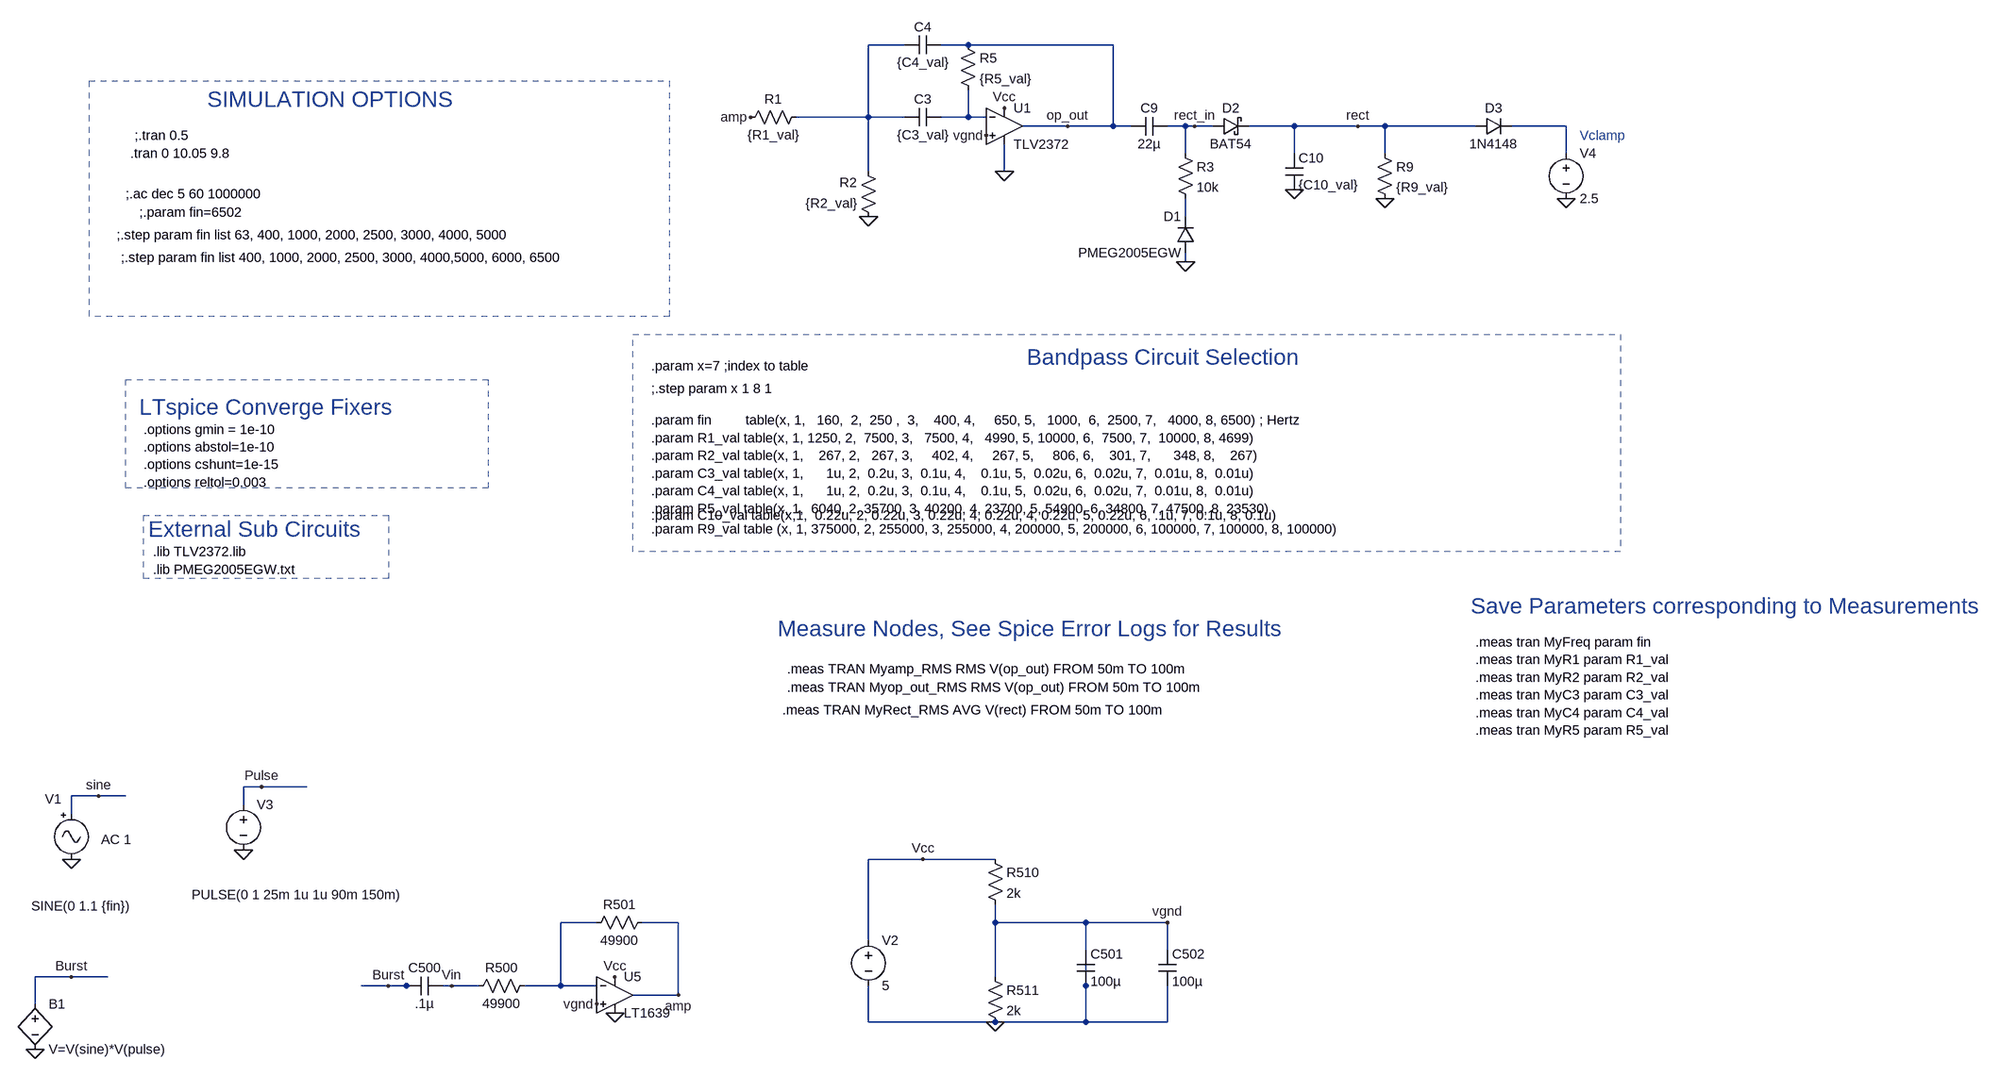
[diagram p0: schematic Single Stage - TLV2372.asc]
Single Stage - TLV2372.asc, the LTspice schematic file:
Version 4
SHEET 1 3616 1460
WIRE 1136 -928 1072 -928
WIRE 1248 -928 1200 -928
WIRE 1504 -928 1248 -928
WIRE 1072 -800 1072 -928
WIRE 1072 -800 944 -800
WIRE 1136 -800 1072 -800
WIRE 1248 -800 1248 -848
WIRE 1248 -800 1200 -800
WIRE 1280 -800 1248 -800
WIRE 1424 -784 1344 -784
WIRE 1504 -784 1504 -928
WIRE 1504 -784 1424 -784
WIRE 1536 -784 1504 -784
WIRE 1632 -784 1600 -784
WIRE 1648 -784 1632 -784
WIRE 1680 -784 1648 -784
WIRE 1824 -784 1744 -784
WIRE 1936 -784 1824 -784
WIRE 1984 -784 1936 -784
WIRE 2144 -784 1984 -784
WIRE 2304 -784 2208 -784
WIRE 1632 -736 1632 -784
WIRE 1824 -736 1824 -784
WIRE 1984 -736 1984 -784
WIRE 2304 -736 2304 -784
WIRE 1072 -704 1072 -800
WIRE 1312 -704 1312 -752
WIRE 1632 -624 1632 -656
WIRE 1632 -544 1632 -560
WIRE 0 384 -32 384
WIRE 80 384 0 384
WIRE -288 400 -336 400
WIRE -240 400 -288 400
WIRE -32 416 -32 384
WIRE -336 432 -336 400
WIRE 1168 512 1072 512
WIRE 1296 512 1168 512
WIRE 592 624 528 624
WIRE 736 624 672 624
WIRE 1296 624 1296 592
WIRE 1456 624 1296 624
WIRE 1600 624 1456 624
WIRE 1072 656 1072 512
WIRE 1456 672 1456 624
WIRE 1600 672 1600 624
WIRE -336 720 -400 720
WIRE -272 720 -336 720
WIRE 1296 720 1296 624
WIRE 224 736 176 736
WIRE 256 736 224 736
WIRE 272 736 256 736
WIRE 336 736 320 736
WIRE 384 736 336 736
WIRE 528 736 528 624
WIRE 528 736 464 736
WIRE 592 736 528 736
WIRE 1456 736 1456 688
WIRE 736 752 736 624
WIRE 736 752 656 752
WIRE -400 768 -400 720
WIRE 1072 800 1072 736
WIRE 1296 800 1072 800
WIRE 1456 800 1456 736
WIRE 1456 800 1296 800
WIRE 1600 800 1600 736
WIRE 1600 800 1456 800
FLAG 1296 800 0
FLAG 1168 512 Vcc
FLAG 1600 624 vgnd
FLAG 1072 -624 0
FLAG 1984 -656 0
FLAG 1312 -704 0
FLAG 1312 -816 Vcc
FLAG 1280 -768 vgnd
FLAG 1824 -672 0
FLAG 864 -800 amp
FLAG 1424 -784 op_out
FLAG 1936 -784 rect
FLAG -336 512 0
FLAG 624 720 Vcc
FLAG 624 784 0
FLAG 736 752 amp
FLAG 336 736 Vin
FLAG 592 768 vgnd
FLAG 1648 -784 rect_in
FLAG -288 400 sine
FLAG -32 496 0
FLAG -400 848 0
FLAG 0 384 Pulse
FLAG -336 720 Burst
FLAG 224 736 Burst
FLAG 1632 -544 0
FLAG 2304 -656 0
SYMBOL voltage 1072 640 R0
WINDOW 123 0 0 Left 0
WINDOW 39 0 0 Left 0
SYMATTR InstName V2
SYMATTR Value 5
SYMBOL res 1280 496 R0
SYMATTR InstName R510
SYMATTR Value 2k
SYMATTR SpiceLine tol=5
SYMBOL res 1280 704 R0
SYMATTR InstName R511
SYMATTR Value 2k
SYMATTR SpiceLine tol=5
SYMBOL cap 1440 672 R0
SYMATTR InstName C501
SYMATTR Value 100µ
SYMBOL cap 1584 672 R0
SYMATTR InstName C502
SYMATTR Value 100µ
SYMBOL res 960 -816 R90
WINDOW 0 0 56 VBottom 2
WINDOW 3 32 56 VTop 2
SYMATTR InstName R1
SYMATTR Value {R1_val}
SYMATTR SpiceLine tol=1
SYMBOL res 1088 -608 R180
WINDOW 0 36 76 Left 2
WINDOW 3 36 40 Left 2
SYMATTR InstName R2
SYMATTR Value {R2_val}
SYMATTR SpiceLine tol=1
SYMBOL cap 1200 -816 R90
WINDOW 0 0 32 VBottom 2
WINDOW 3 32 32 VTop 2
SYMATTR InstName C3
SYMATTR Value {C3_val}
SYMBOL res 1232 -944 R0
SYMATTR InstName R5
SYMATTR Value {R5_val}
SYMATTR SpiceLine tol=1
SYMBOL cap 1200 -944 R90
WINDOW 0 0 32 VBottom 2
WINDOW 3 32 32 VTop 2
SYMATTR InstName C4
SYMATTR Value {C4_val}
SYMBOL schottky 1680 -768 R270
WINDOW 0 32 32 VTop 2
WINDOW 3 0 32 VBottom 2
SYMATTR InstName D2
SYMATTR Value BAT54
SYMATTR Description Diode
SYMATTR Type diode
SYMBOL res 1968 -752 R0
SYMATTR InstName R9
SYMATTR Value {R9_val}
SYMATTR SpiceLine tol=5
SYMBOL cap 1600 -800 R90
WINDOW 0 0 32 VBottom 2
WINDOW 3 32 32 VTop 2
SYMATTR InstName C9
SYMATTR Value 22µ
SYMBOL cap 1808 -736 R0
SYMATTR InstName C10
SYMATTR Value {C10_val}
SYMBOL cap 320 720 R90
WINDOW 0 0 32 VBottom 2
WINDOW 3 32 32 VTop 2
SYMATTR InstName C500
SYMATTR Value .1µ
SYMBOL res 480 720 R90
WINDOW 0 0 56 VBottom 2
WINDOW 3 32 56 VTop 2
SYMATTR InstName R500
SYMATTR Value 49900
SYMATTR SpiceLine tol=1
SYMBOL Misc\\signal -336 416 R0
WINDOW 0 -32 5 Bottom 2
WINDOW 3 17 163 Top 2
WINDOW 123 79 46 Top 2
WINDOW 39 0 0 Left 0
SYMATTR InstName V1
SYMATTR Value SINE(0 1.1 {fin})
SYMATTR Value2 AC 1
SYMBOL Opamps\\LT1639 624 688 R0
SYMATTR InstName U5
SYMBOL res 688 608 R90
WINDOW 0 0 56 VBottom 2
WINDOW 3 32 56 VTop 2
SYMATTR InstName R501
SYMATTR Value 49900
SYMATTR SpiceLine tol=1
SYMBOL Opamps\\opamp2 1312 -848 R0
SYMATTR InstName U1
SYMATTR Value TLV2372
SYMBOL bv -400 752 R0
SYMATTR InstName B1
SYMATTR Value V=V(sine)*V(pulse)
SYMBOL voltage -32 400 R0
WINDOW 3 -91 175 Left 2
WINDOW 123 0 0 Left 0
WINDOW 39 0 0 Left 0
SYMATTR Value PULSE(0 1 25m 1u 1u 90m 150m)
SYMATTR InstName V3
SYMBOL res 1616 -752 R0
SYMATTR InstName R3
SYMATTR Value 10k
SYMBOL voltage 2304 -752 R0
WINDOW 123 0 0 Left 0
WINDOW 39 0 0 Left 0
SYMATTR InstName V4
SYMATTR Value 2.5
SYMBOL diode 2144 -768 R270
WINDOW 0 32 32 VTop 2
WINDOW 3 0 32 VBottom 2
SYMATTR InstName D3
SYMATTR Value 1N4148
SYMBOL diode 1648 -560 R180
WINDOW 0 24 64 Left 2
WINDOW 3 24 0 Left 2
SYMATTR InstName D1
SYMATTR Value PMEG2005EGW
SYMATTR Prefix X
TEXT -256 -592 Left 2 !;.step param fin list 63, 400, 1000, 2000, 2500, 3000, 4000, 5000
TEXT -248 -552 Left 2 !;.step param fin list 400, 1000, 2000, 2500, 3000, 4000,5000, 6000, 6500
TEXT -216 -632 Left 2 !;.param fin=6502
TEXT -224 -768 Left 2 !;.tran 0.5
TEXT -240 -664 Left 2 !;.ac dec 5 60 1000000
TEXT 688 -360 Left 2 !.param x=7 ;index to table
TEXT 688 -264 Left 2 !.param fin         table(x, 1,   160,  2,  250 ,  3,    400, 4,     650, 5,   1000,  6,  2500, 7,   4000, 8, 6500) ; Hertz\n.param R1_val table(x, 1, 1250, 2,  7500, 3,   7500, 4,   4990, 5, 10000, 6,  7500, 7,  10000, 8, 4699)\n.param R2_val table(x, 1,    267, 2,   267, 3,     402, 4,     267, 5,     806, 6,    301, 7,      348, 8,    267)\n.param C3_val table(x, 1,      1u, 2,  0.2u, 3,  0.1u, 4,    0.1u, 5,  0.02u, 6,  0.02u, 7,  0.01u, 8,  0.01u)\n.param C4_val table(x, 1,      1u, 2,  0.2u, 3,  0.1u, 4,    0.1u, 5,  0.02u, 6,  0.02u, 7,  0.01u, 8,  0.01u)\n.param R5_val table(x, 1,  6040, 2, 35700, 3, 40200, 4, 23700, 5, 54900, 6, 34800, 7, 47500, 8, 23530)
TEXT 928 176 Left 2 !.meas TRAN Myamp_RMS RMS V(op_out) FROM 50m TO 100m
TEXT 928 208 Left 2 !.meas TRAN Myop_out_RMS RMS V(op_out) FROM 50m TO 100m
TEXT 920 248 Left 2 !.meas TRAN MyRect_RMS AVG V(rect) FROM 50m TO 100m
TEXT 2144 128 Left 2 !.meas tran MyFreq param fin\n.meas tran MyR1 param R1_val\n.meas tran MyR2 param R2_val\n.meas tran MyC3 param C3_val\n.meas tran MyC4 param C4_val\n.meas tran MyR5 param R5_val
TEXT 688 -320 Left 2 !;.step param x 1 8 1
TEXT -192 -32 Left 2 !.lib TLV2372.lib
TEXT -208 -248 Left 2 !.options gmin = 1e-10\n.options abstol=1e-10\n.options cshunt=1e-15\n.options reltol=0.003
TEXT -96 -832 Left 4 ;SIMULATION OPTIONS
TEXT -216 -288 Left 4 ;LTspice Converge Fixers
TEXT -200 -72 Left 4 ;External Sub Circuits
TEXT 912 104 Left 4 ;Measure Nodes, See Spice Error Logs for Results
TEXT 1352 -376 Left 4 ;Bandpass Circuit Selection
TEXT 2136 64 Left 4 ;Save Parameters corresponding to Measurements
TEXT 688 -96 Left 2 !.param C10_val table(x,1,  0.22u, 2, 0.22u, 3, 0.22u, 4, 0.22u, 4, 0.22u, 5, 0.22u, 6, .1u, 7, 0.1u, 8, 0.1u)
TEXT 688 -72 Left 2 !.param R9_val table (x, 1, 375000, 2, 255000, 3, 255000, 4, 200000, 5, 200000, 6, 100000, 7, 100000, 8, 100000)
TEXT 2328 -768 Left 2 ;Vclamp
TEXT -232 -736 Left 2 !.tran 0 10.05 9.8
TEXT -192 0 Left 2 !.lib PMEG2005EGW.txt
RECTANGLE Normal 720 -448 -304 -864 2
RECTANGLE Normal 400 -144 -240 -336 2
RECTANGLE Normal 2400 -32 656 -416 2
RECTANGLE Normal 224 16 -208 -96 2

The netlist it stands for:
* Single Stage - TLV2372.asc
V2 Vcc 0 5
R510 Vcc vgnd 2k tol=5
R511 vgnd 0 2k tol=5
C501 vgnd 0 100µ
C502 vgnd 0 100µ
R1 N001 amp {R1_val} tol=1
R2 0 N001 {R2_val} tol=1
C3 N002 N001 {C3_val}
R5 op_out N002 {R5_val} tol=1
C4 op_out N001 {C4_val}
D2 rect_in rect BAT54
R9 rect 0 {R9_val} tol=5
C9 rect_in op_out 22µ
C10 rect 0 {C10_val}
C500 Vin Burst .1µ
R500 N005 Vin 49900 tol=1
V1 sine 0 SINE(0 1.1 {fin}) AC 1
XU5 vgnd N005 Vcc 0 amp LT1639  ; pins In+ In- V+ V- OUT
R501 amp N005 49900 tol=1
XU1 vgnd N002 Vcc 0 op_out TLV2372  ; pins In+ In- V+ V- OUT
B1 Burst 0 V=V(sine)*V(pulse)
V3 Pulse 0 PULSE(0 1 25m 1u 1u 90m 150m)
R3 rect_in N004 10k
V4 N003 0 2.5
D3 rect N003 1N4148
XD1 0 N004 PMEG2005EGW  ; pins + -
.model D D
.lib standard.dio
;.step param fin list 63, 400, 1000, 2000, 2500, 3000, 4000, 5000
;.step param fin list 400, 1000, 2000, 2500, 3000, 4000,5000, 6000, 6500
;.param fin=6502
;.tran 0.5
;.ac dec 5 60 1000000
.param x=7 ;index to table
.param fin         table(x, 1,   160,  2,  250 ,  3,    400, 4,     650, 5,   1000,  6,  2500, 7,   4000, 8, 6500) ; Hertz
.param R1_val table(x, 1, 1250, 2,  7500, 3,   7500, 4,   4990, 5, 10000, 6,  7500, 7,  10000, 8, 4699)
.param R2_val table(x, 1,    267, 2,   267, 3,     402, 4,     267, 5,     806, 6,    301, 7,      348, 8,    267)
.param C3_val table(x, 1,      1u, 2,  0.2u, 3,  0.1u, 4,    0.1u, 5,  0.02u, 6,  0.02u, 7,  0.01u, 8,  0.01u)
.param C4_val table(x, 1,      1u, 2,  0.2u, 3,  0.1u, 4,    0.1u, 5,  0.02u, 6,  0.02u, 7,  0.01u, 8,  0.01u)
.param R5_val table(x, 1,  6040, 2, 35700, 3, 40200, 4, 23700, 5, 54900, 6, 34800, 7, 47500, 8, 23530)
.meas TRAN Myamp_RMS RMS V(op_out) FROM 50m TO 100m
.meas TRAN Myop_out_RMS RMS V(op_out) FROM 50m TO 100m
.meas TRAN MyRect_RMS AVG V(rect) FROM 50m TO 100m
.meas tran MyFreq param fin
.meas tran MyR1 param R1_val
.meas tran MyR2 param R2_val
.meas tran MyC3 param C3_val
.meas tran MyC4 param C4_val
.meas tran MyR5 param R5_val
;.step param x 1 8 1
.lib TLV2372.lib
.options gmin = 1e-10
.options abstol=1e-10
.options cshunt=1e-15
.options reltol=0.003
* SIMULATION OPTIONS
* LTspice Converge Fixers
* External Sub Circuits
* Measure Nodes, See Spice Error Logs for Results
* Bandpass Circuit Selection
* Save Parameters corresponding to Measurements
.param C10_val table(x,1,  0.22u, 2, 0.22u, 3, 0.22u, 4, 0.22u, 4, 0.22u, 5, 0.22u, 6, .1u, 7, 0.1u, 8, 0.1u)
.param R9_val table (x, 1, 375000, 2, 255000, 3, 255000, 4, 200000, 5, 200000, 6, 100000, 7, 100000, 8, 100000)
* Vclamp
.tran 0 10.05 9.8
.lib PMEG2005EGW.txt
.backanno
.end